# Altium schematic sheet 电池箱内部原理图.SchDoc
size A4; SheetNumber: 3; SheetTotal: 9
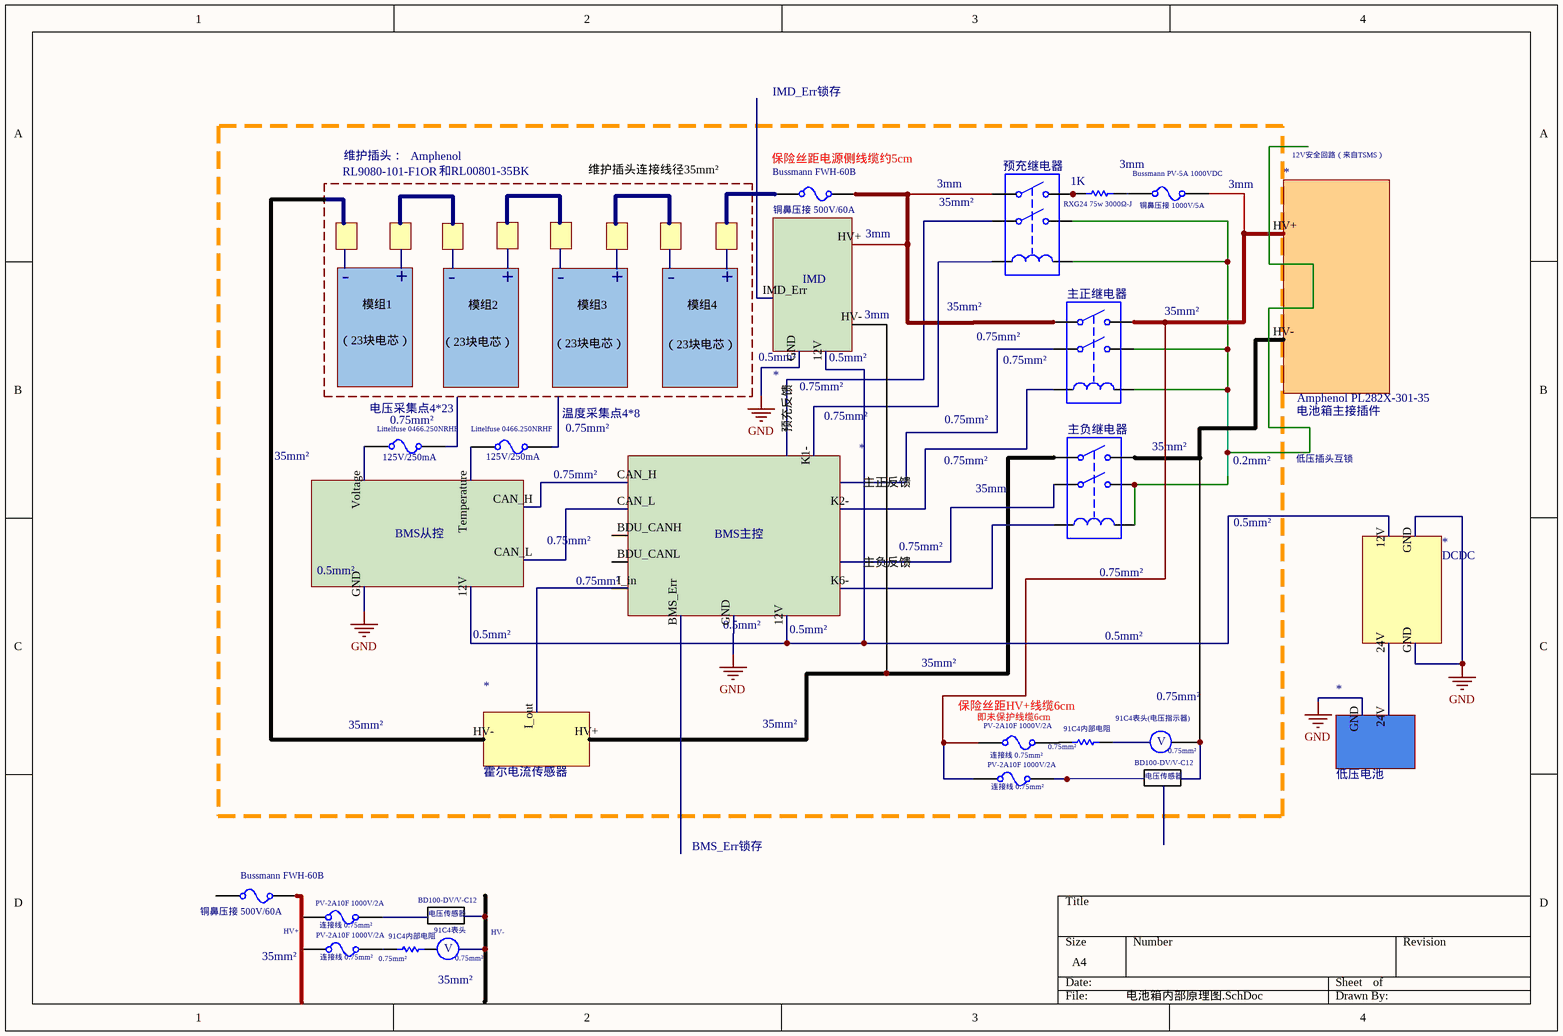
[diagram p0: 电池箱内部原理图.SchDoc]

## Parts
(Parts that share a designator on the sheet are numbered #1, #2 ... from top to bottom, then left to right.)
91C4内部电阻#1  Resistor  (value not drawn)
91C4内部电阻#2  Resistor  (value not drawn)
*#1  IMD
*#2  Amphenol PL282X-301-35
*#3  BMS从控
*#4  BMS主控
*#5  DCDC
*#6  霍尔电流传感器
*#7  低压电池
Bussmann_FWH-60B#1  Fuse  (value not drawn)
Bussmann_FWH-60B#2  Fuse  (value not drawn)
Bussmann_PV-5A_1000VDC  Fuse  (value not drawn)
Littelfuse_0466.250NRHF#1  CURRENT: 125V/250mA  (hidden comment: Fuse)
Littelfuse_0466.250NRHF#2  CURRENT: 125V/250mA  (hidden comment: Fuse)
PV-2A10F_1000V/2A#1  连接线 0.75mm²
PV-2A10F_1000V/2A#2  连接线 0.75mm²
PV-2A10F_1000V/2A#3  连接线 0.75mm²
PV-2A10F_1000V/2A#4  连接线 0.75mm²
RXG24_75w_3000Ω-J  value 1K  (hidden comment: Resistor)
主正继电器  Double-Pole, Single-Throw Relay  (value not drawn)
主负继电器  Double-Pole, Single-Throw Relay  (value not drawn)
预充继电器  Double-Pole, Single-Throw Relay  (value not drawn)

## Nets
GND: *#1.GND *#3.GND *#4.GND *#5.GND *#7.GND
Net91C4内部电阻#2_1: 91C4内部电阻#2.1 PV-2A10F_1000V/2A#4.2
Net*#1_12V: *#1.12V *#3.12V *#4.12V *#5.12V
Net*#1_HV+: *#1.HV+ Bussmann_FWH-60B#1.2 主正继电器.1 预充继电器.1
Net*#1_HV-: *#1.HV- *#6.HV+ 主负继电器.1
Net*#2_HV+: *#2.HV+ Bussmann_PV-5A_1000VDC.2 PV-2A10F_1000V/2A#1.1 PV-2A10F_1000V/2A#2.1 主正继电器.2
Net*#2_HV-: *#2.HV- 主负继电器.2
Net*#3_CAN_H: *#3.CAN_H *#4.CAN_H
Net*#3_CAN_L: *#3.CAN_L *#4.CAN_L
Net*#3_Temperature: *#3.Temperature Littelfuse_0466.250NRHF#2.1
Net*#3_Voltage: *#3.Voltage Littelfuse_0466.250NRHF#1.1
Net*#4_?1: *#4.?1(主负反馈) 主负继电器.3
Net*#4_?2: *#4.?2(主正反馈) 主正继电器.3
Net*#4_?3: *#4.?3(预充反馈) 预充继电器.3
Net*#4_I_in: *#4.I_in *#6.I_out
Net*#4_K1-: *#4.K1- 预充继电器.5
Net*#4_K2-: *#4.K2- 主正继电器.5
Net*#4_K6-: *#4.K6- 主负继电器.5
Net*#5_24V: *#5.24V *#7.24V
NetBussmann_FWH-60B#2_1: Bussmann_FWH-60B#2.1 PV-2A10F_1000V/2A#3.1 PV-2A10F_1000V/2A#4.1
NetBussmann_PV-5A_1000VDC_1: Bussmann_PV-5A_1000VDC.1 RXG24_75w_3000Ω-J.2
NetRXG24_75w_3000Ω-J_1: RXG24_75w_3000Ω-J.1 预充继电器.2
Net主正继电器_4: 主正继电器.4 主正继电器.6 主负继电器.4 主负继电器.6 预充继电器.4 预充继电器.6

Not connected (* = marked no-connect by the designer): 91C4内部电阻#1 1 2; 91C4内部电阻#2 2; *#1 IMD_Err; *#4 BDU_CANH BDU_CANL BMS_Err; *#6 HV-; Bussmann_FWH-60B#1 1; Bussmann_FWH-60B#2 2; Littelfuse_0466.250NRHF#1 2; Littelfuse_0466.250NRHF#2 2; PV-2A10F_1000V/2A#1 2; PV-2A10F_1000V/2A#2 2; PV-2A10F_1000V/2A#3 2

## Notes on the sheet
- IMD_Err锁存
- RL9080-101-F1OR
- 维护插头：
- Amphenol
- 和RL00801-35BK
- 维护插头连接线径35mm²
- (near Bussmann_FWH-60B#1) 保险丝距电源侧线缆约5cm
- 3mm
- 12V安全回路（来自TSMS）
- (near Bussmann_FWH-60B#1) 铜鼻压接 500V/60A
- (near *#1) 3mm
- (near 预充继电器) 35mm²
- (near Bussmann_PV-5A_1000VDC) 铜鼻压接 1000V/5A
- -
- 模组1
- +
- 模组2
- 模组3
- (near *#1) 模组4
- (near *#1) +
- 35mm²
- （23块电芯）
- (near *#1) （23块电芯）
- (near *#1) 0.5mm²
- 0.75mm²
- (near 主正继电器) 0.75mm²
- 电压采集点4*23
- (near Littelfuse_0466.250NRHF#1) 0.75mm²
- (near *#4) 温度采集点4*8
- (near *#4) 0.75mm²
- (near *#1) 0.75mm²
- (near 主负继电器) 35mm²
- 电池箱主接插件
- (near *#3) 0.75mm²
- 0.2mm²
- 低压插头互锁
- (near *#3) 0.5mm²
- (near 主负继电器) 0.75mm²
- 0.5mm²
- (near *#4) 0.5mm²
- (near PV-2A10F_1000V/2A#1) 保险丝距HV+线缆6cm
- (near PV-2A10F_1000V/2A#1) 即未保护线缆6cm
- (near 91C4内部电阻#1) 91C4表头(电压指示器)
- (near 91C4内部电阻#1) 0.75mm²
- (near 91C4内部电阻#1) BD100-DV/V-C12
- 电压传感器
- V
- BMS_Err锁存
- (near Bussmann_FWH-60B#2) 铜鼻压接 500V/60A
- BD100-DV/V-C12
- (near 91C4内部电阻#2) 电压传感器
- (near PV-2A10F_1000V/2A#4) 35mm²
- HV+
- (near 91C4内部电阻#2) 0.75mm²
- (near 91C4内部电阻#2) 91C4表头
- (near 91C4内部电阻#2) 35mm²
- (near 91C4内部电阻#2) V
- HV-

## Library data of the parts
91C4内部电阻#1 91C4内部电阻#2 = Resistor: TC1: 0; SimulationGenericComponent: True; Value: 1K; TC2: 0
Bussmann_FWH-60B#1 Bussmann_FWH-60B#2 Bussmann_PV-5A_1000VDC PV-2A10F_1000V/2A#1-PV-2A10F_1000V/2A#4 = Fuse: RESISTANCE: 1m; SimulationGenericComponent: True; CURRENT: 1
Littelfuse_0466.250NRHF#1 Littelfuse_0466.250NRHF#2 = Fuse: RESISTANCE: 1m; SimulationGenericComponent: True
RXG24_75w_3000Ω-J = Resistor: TC1: 0; SimulationGenericComponent: True; TC2: 0
主正继电器 主负继电器 预充继电器 = DPST Relay: L_C: 1u; R_C: 100; RON: 1; ROFF: 1e12; ION: 1m; IOFF: 0; SimulationGenericComponent: True